# EasyEDA schematic Electrical Schematic (EasyEDA).json
TITLE: Derby Main; REV: 1.0; Date: 2022-11-14; Sheet: 1/1; Company: Me
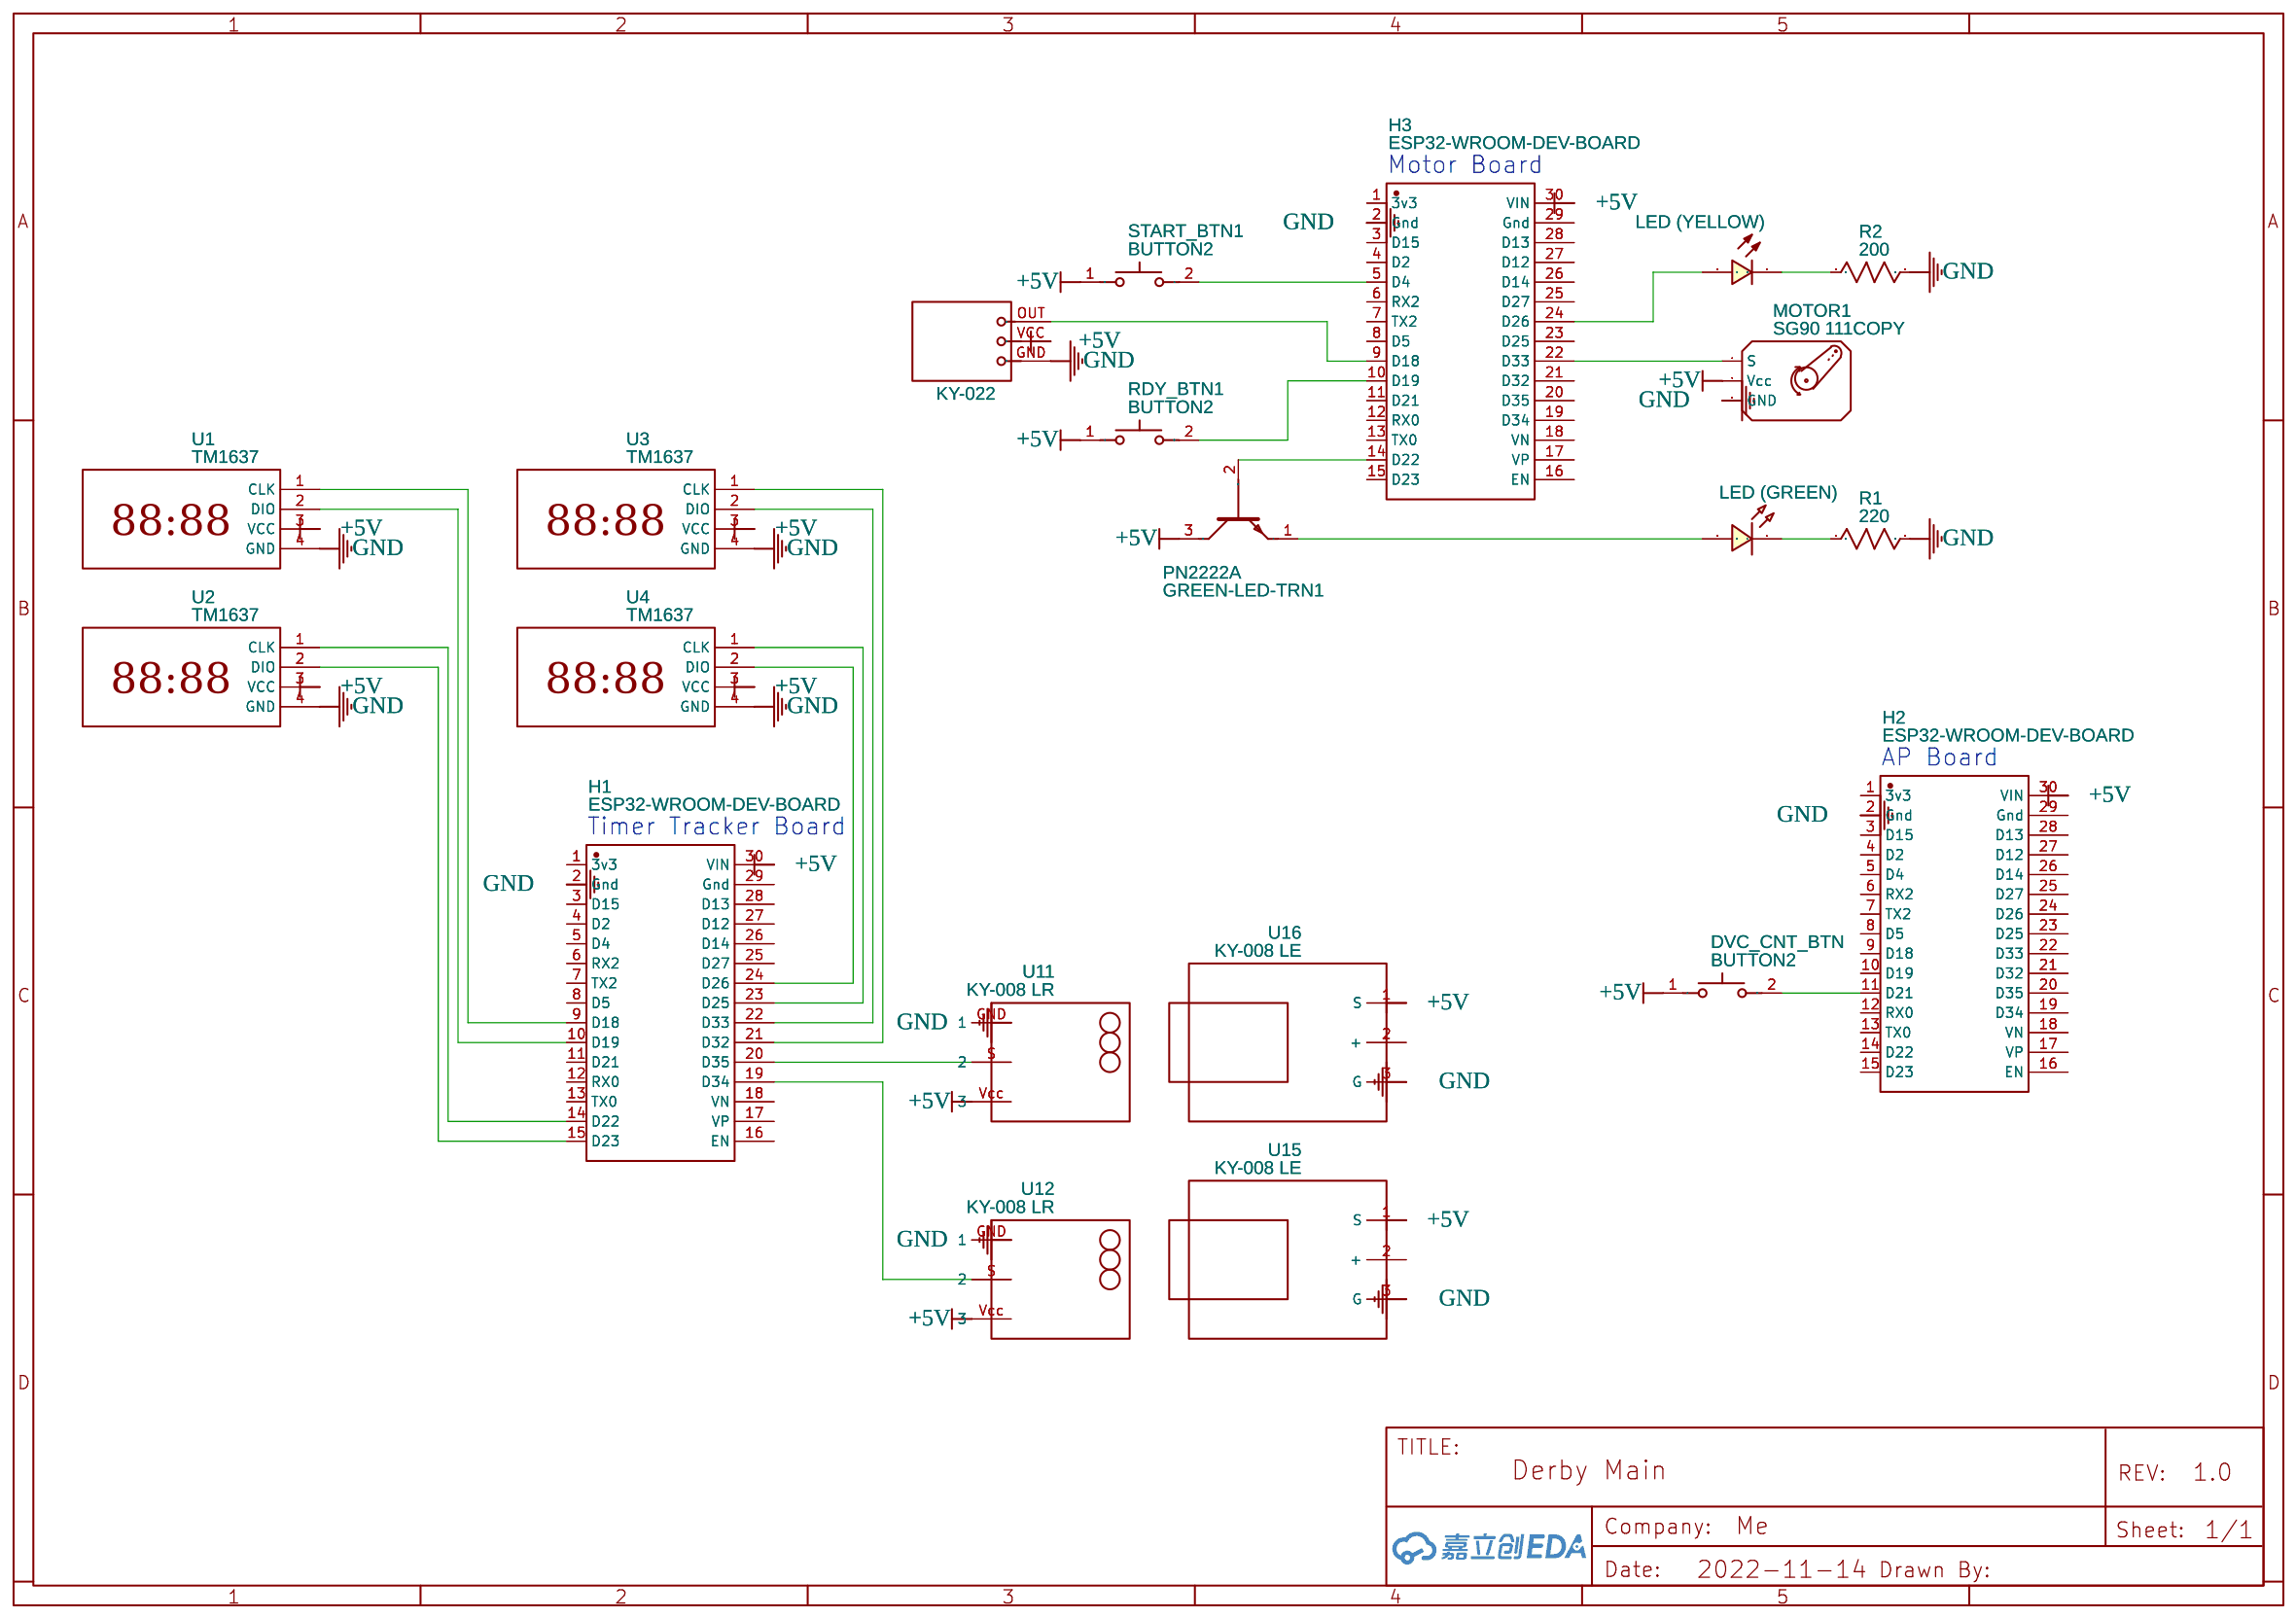
[diagram p0: schematic sheet]

## Parts
DVC_CNT_BTN  BUTTON2  [SW-SMD_L6.0-W3.5-LS8.0-1]
GREEN-LED-TRN1  PN2222A  [PN2222A]
H1  ESP32-WROOM-DEV-BOARD  [ESP32-WROOM-DEV-BOARD]
H2  ESP32-WROOM-DEV-BOARD  [ESP32-WROOM-DEV-BOARD]
H3  ESP32-WROOM-DEV-BOARD  [ESP32-WROOM-DEV-BOARD]
LED1  LED (GREEN)  [LED-TH_6P_LED4GREEN]
LED2  LED (YELLOW)  [LED0603-RD-YELLOW]
MOTOR1  SG90 111COPY  [SG90]
R1  220  [R_AXIAL-0.6]
R2  200  [R_AXIAL-0.6]
RDY_BTN1  BUTTON2  [SW-SMD_L6.0-W3.5-LS8.0-1]
START_BTN1  BUTTON2  [SW-SMD_L6.0-W3.5-LS8.0-1]
U1  TM1637  [TM1637-PCB]
U2  TM1637  [TM1637-PCB]
U3  TM1637  [TM1637-PCB]
U4  TM1637  [TM1637-PCB]
U5  KY-022  [KY-022]
U11  KY-008 LR
U12  KY-008 LR
U15  KY-008 LE  [KYYY]
U16  KY-008 LE  [KYYY]

## Library data of the parts
DVC_CNT_BTN RDY_BTN1 START_BTN1 = BUTTON2: Supplier: LCSC; Supplier Part: C9900005988; Manufacturer: null; JLCPCB Part Class: Extended Part; Contributor: LCSC
GREEN-LED-TRN1 = PN2222A: Contributor: Ryan Bluhm
H1-H3 = ESP32-WROOM-DEV-BOARD: Supplier Part: ESP32; Manufacturer: ESPRESSIF; Manufacturer Part: ESP32-WROOM-DEV; Contributor: Tiaan Giliomee; JLCPCB Part Class: Extended Part
LED1 = LED (GREEN): Supplier: LCSC; Supplier Part: C9900027004; Manufacturer: null; Manufacturer Part: LED三色(Red,Yellow,Green); link: https://atta.szlcsc.comnull; Contributor: boumninaotman7
LED2 = Yellow LED: Supplier: LCSC; Supplier Part: C264455; Manufacturer: Everlight Elec; Manufacturer Part: 19-213/Y2C-CQ1R1L/3T; Contributor: GeneAlexis; JLCPCB Part Class: Extended Part
MOTOR1 = SG90 111COPY: Contributor: CARLOS DANIEL JIMENEZ PAZ
R1 R2 = R_AXIAL-0.6_US: Contributor: LCEDA_Lib
U1-U4 = TM1637: Contributor: ahmad2ghafari
U5 = KY-022: Contributor: umutyuksel
U11 U12 = Laser Receiver (KY-008): Supplier Part: KY-008; Contributor: estark
U15 U16 = KY-008//: Contributor: nikitataran11033

## Nets
+5V: DVC_CNT_BTN.1 GREEN-LED-TRN1.3(C) H1.30(VIN) H2.30(VIN) H3.30(VIN) MOTOR1.2(Vcc) RDY_BTN1.1 START_BTN1.1 U1.3(VCC) U2.3(VCC) U3.3(VCC) U4.3(VCC) U5.VCC(2) U15.1(S) U16.1(S)
GND: H1.2(Gnd) H2.2(Gnd) H3.2(Gnd) MOTOR1.3(GND) R1.2 R2.2 U1.4(GND) U2.4(GND) U3.4(GND) U4.4(GND) U5.GND(1) U11.GND(1) U12.GND(1) U15.3(G) U16.3(G)
Net-(DVC_CNT_BTN-2): DVC_CNT_BTN.2 H2.11(D21)
Net-(GREEN-LED-TRN1-1): GREEN-LED-TRN1.1(E) LED1.2
Net-(GREEN-LED-TRN1-2): GREEN-LED-TRN1.2(B) H3.14(D22)
Net-(H1-9): H1.9(D18) U1.1(CLK)
Net-(H1-10): H1.10(D19) U1.2(DIO)
Net-(H1-14): H1.14(D22) U2.1(CLK)
Net-(H1-15): H1.15(D23) U2.2(DIO)
Net-(H1-19): H1.19(D34) U12.S(2)
Net-(H1-20): H1.20(D35) U11.S(2)
Net-(H1-21): H1.21(D32) U3.1(CLK)
Net-(H1-22): H1.22(D33) U3.2(DIO)
Net-(H1-23): H1.23(D25) U4.1(CLK)
Net-(H1-24): H1.24(D26) U4.2(DIO)
Net-(H3-5): H3.5(D4) START_BTN1.2
Net-(H3-9): H3.9(D18) U5.OUT(3)
Net-(H3-10): H3.10(D19) RDY_BTN1.2
Net-(H3-22): H3.22(D33) MOTOR1.1(S)
Net-(H3-24): H3.24(D26) LED2.2(A)
Net-(LED1-1): LED1.1 R1.1
Net-(LED2-1): LED2.1(C) R2.1

Not connected (* = marked no-connect by the designer): H1 1(3v3) 3(D15) 4(D2) 5(D4) 6(RX2) 7(TX2) 8(D5) 11(D21) 12(RX0) 13(TX0) 16(EN) 17(VP) 18(VN) 25(D27) 26(D14) 27(D12) 28(D13) 29(Gnd); H2 1(3v3) 3(D15) 4(D2) 5(D4) 6(RX2) 7(TX2) 8(D5) 9(D18) 10(D19) 12(RX0) 13(TX0) 14(D22) 15(D23) 16(EN) 17(VP) 18(VN) 19(D34) 20(D35) 21(D32) 22(D33) 23(D25) 24(D26) 25(D27) 26(D14) 27(D12) 28(D13) 29(Gnd); H3 1(3v3) 3(D15) 4(D2) 6(RX2) 7(TX2) 8(D5) 11(D21) 12(RX0) 13(TX0) 15(D23) 16(EN) 17(VP) 18(VN) 19(D34) 20(D35) 21(D32) 23(D25) 25(D27) 26(D14) 27(D12) 28(D13) 29(Gnd); U11 Vcc(3); U12 Vcc(3); U15 2(+); U16 2(+)

## Notes on the sheet
- Motor Board
- AP Board
- Timer Tracker Board
